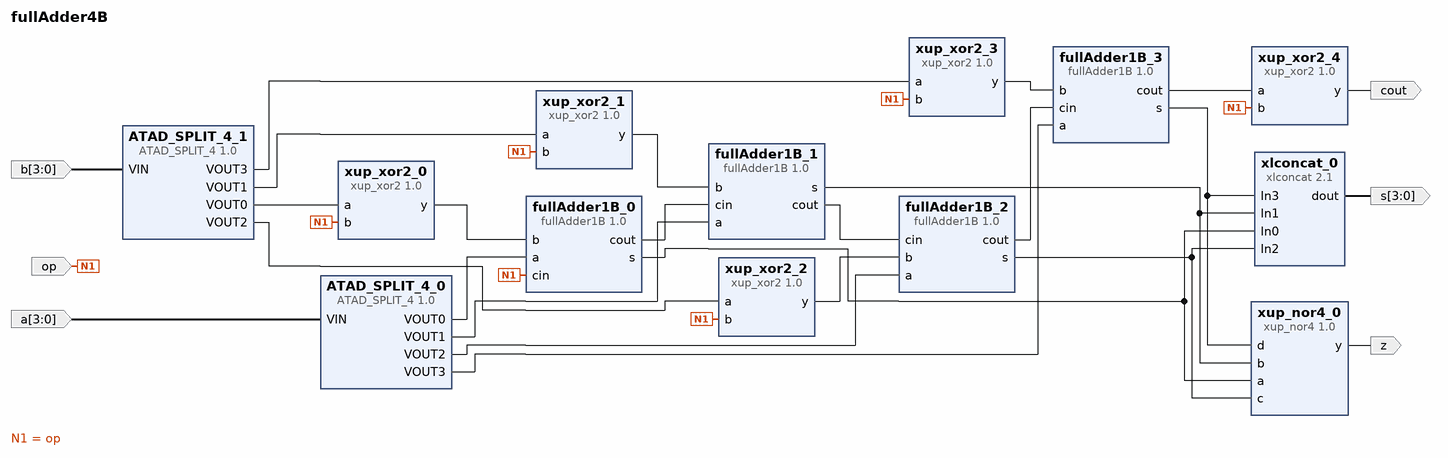
[diagram p0: block diagram of the top level]
# Vivado block design fullAdder4B, xc7a100tcsg324-1, Vivado 2020.1
create_bd_design fullAdder4B

create_bd_port -dir I -from 3 -to 0 a
create_bd_port -dir I -from 3 -to 0 b
create_bd_port -dir O -from 3 -to 0 s
create_bd_port -dir I op
create_bd_port -dir O z
create_bd_port -dir O cout

create_bd_cell -type ip -vlnv xilinx.com:user:fullAdder1B:1.0 fullAdder1B_0
create_bd_cell -type ip -vlnv xilinx.com:user:fullAdder1B:1.0 fullAdder1B_1
create_bd_cell -type ip -vlnv xilinx.com:user:fullAdder1B:1.0 fullAdder1B_2
create_bd_cell -type ip -vlnv xilinx.com:user:fullAdder1B:1.0 fullAdder1B_3
create_bd_cell -type ip -vlnv xilinx.com:xup:xup_xor2:1.0 xup_xor2_0
create_bd_cell -type ip -vlnv xilinx.com:xup:xup_xor2:1.0 xup_xor2_1
create_bd_cell -type ip -vlnv xilinx.com:xup:xup_xor2:1.0 xup_xor2_2
create_bd_cell -type ip -vlnv xilinx.com:xup:xup_xor2:1.0 xup_xor2_3
create_bd_cell -type ip -vlnv xilinx.com:xup:xup_xor2:1.0 xup_xor2_4
create_bd_cell -type ip -vlnv xilinx.com:xup:xup_nor4:1.0 xup_nor4_0
create_bd_cell -type ip -vlnv xilinx.com:user:ATAD_SPLIT_4:1.0 ATAD_SPLIT_4_0
create_bd_cell -type ip -vlnv xilinx.com:user:ATAD_SPLIT_4:1.0 ATAD_SPLIT_4_1
create_bd_cell -type ip -vlnv xilinx.com:ip:xlconcat:2.1 xlconcat_0
set_property -dict {CONFIG.NUM_PORTS 4} [get_bd_cells xlconcat_0]

# ---- connections ----

connect_bd_net [get_bd_ports op] \
  [get_bd_pins xup_xor2_1/b] [get_bd_pins xup_xor2_2/b] [get_bd_pins xup_xor2_3/b] [get_bd_pins xup_xor2_0/b] \
  [get_bd_pins fullAdder1B_0/cin] [get_bd_pins xup_xor2_4/b]
connect_bd_net [get_bd_pins xup_xor2_0/y] [get_bd_pins fullAdder1B_0/b]
connect_bd_net [get_bd_pins xup_xor2_1/y] [get_bd_pins fullAdder1B_1/b]
connect_bd_net [get_bd_pins xup_xor2_2/y] [get_bd_pins fullAdder1B_2/b]
connect_bd_net [get_bd_pins xup_xor2_3/y] [get_bd_pins fullAdder1B_3/b]
connect_bd_net [get_bd_pins fullAdder1B_0/cout] [get_bd_pins fullAdder1B_1/cin]
connect_bd_net [get_bd_pins fullAdder1B_1/cout] [get_bd_pins fullAdder1B_2/cin]
connect_bd_net [get_bd_pins fullAdder1B_2/cout] [get_bd_pins fullAdder1B_3/cin]
connect_bd_net [get_bd_pins fullAdder1B_0/s] [get_bd_pins xup_nor4_0/a] [get_bd_pins xlconcat_0/In0]
connect_bd_net [get_bd_pins fullAdder1B_1/s] [get_bd_pins xup_nor4_0/b] [get_bd_pins xlconcat_0/In1]
connect_bd_net [get_bd_pins fullAdder1B_2/s] [get_bd_pins xup_nor4_0/c] [get_bd_pins xlconcat_0/In2]
connect_bd_net [get_bd_pins fullAdder1B_3/s] [get_bd_pins xup_nor4_0/d] [get_bd_pins xlconcat_0/In3]
connect_bd_net [get_bd_pins fullAdder1B_3/cout] [get_bd_pins xup_xor2_4/a]
connect_bd_net [get_bd_pins xup_nor4_0/y] [get_bd_ports z]
connect_bd_net [get_bd_pins xup_xor2_4/y] [get_bd_ports cout]
connect_bd_net [get_bd_ports a] [get_bd_pins ATAD_SPLIT_4_0/VIN]
connect_bd_net [get_bd_ports b] [get_bd_pins ATAD_SPLIT_4_1/VIN]
connect_bd_net [get_bd_pins xlconcat_0/dout] [get_bd_ports s]
connect_bd_net [get_bd_pins ATAD_SPLIT_4_0/VOUT0] [get_bd_pins fullAdder1B_0/a]
connect_bd_net [get_bd_pins ATAD_SPLIT_4_0/VOUT1] [get_bd_pins fullAdder1B_1/a]
connect_bd_net [get_bd_pins ATAD_SPLIT_4_0/VOUT2] [get_bd_pins fullAdder1B_2/a]
connect_bd_net [get_bd_pins ATAD_SPLIT_4_0/VOUT3] [get_bd_pins fullAdder1B_3/a]
connect_bd_net [get_bd_pins ATAD_SPLIT_4_1/VOUT0] [get_bd_pins xup_xor2_0/a]
connect_bd_net [get_bd_pins ATAD_SPLIT_4_1/VOUT1] [get_bd_pins xup_xor2_1/a]
connect_bd_net [get_bd_pins ATAD_SPLIT_4_1/VOUT2] [get_bd_pins xup_xor2_2/a]
connect_bd_net [get_bd_pins ATAD_SPLIT_4_1/VOUT3] [get_bd_pins xup_xor2_3/a]

validate_bd_design
save_bd_design
